# EasyEDA schematic SHC_USB_HUB.json
TITLE: Sheet_1; REV: 1.0; Date: 2024-05-03; Sheet: 1/1; Drawn By: scooter_y; Company: Your Company
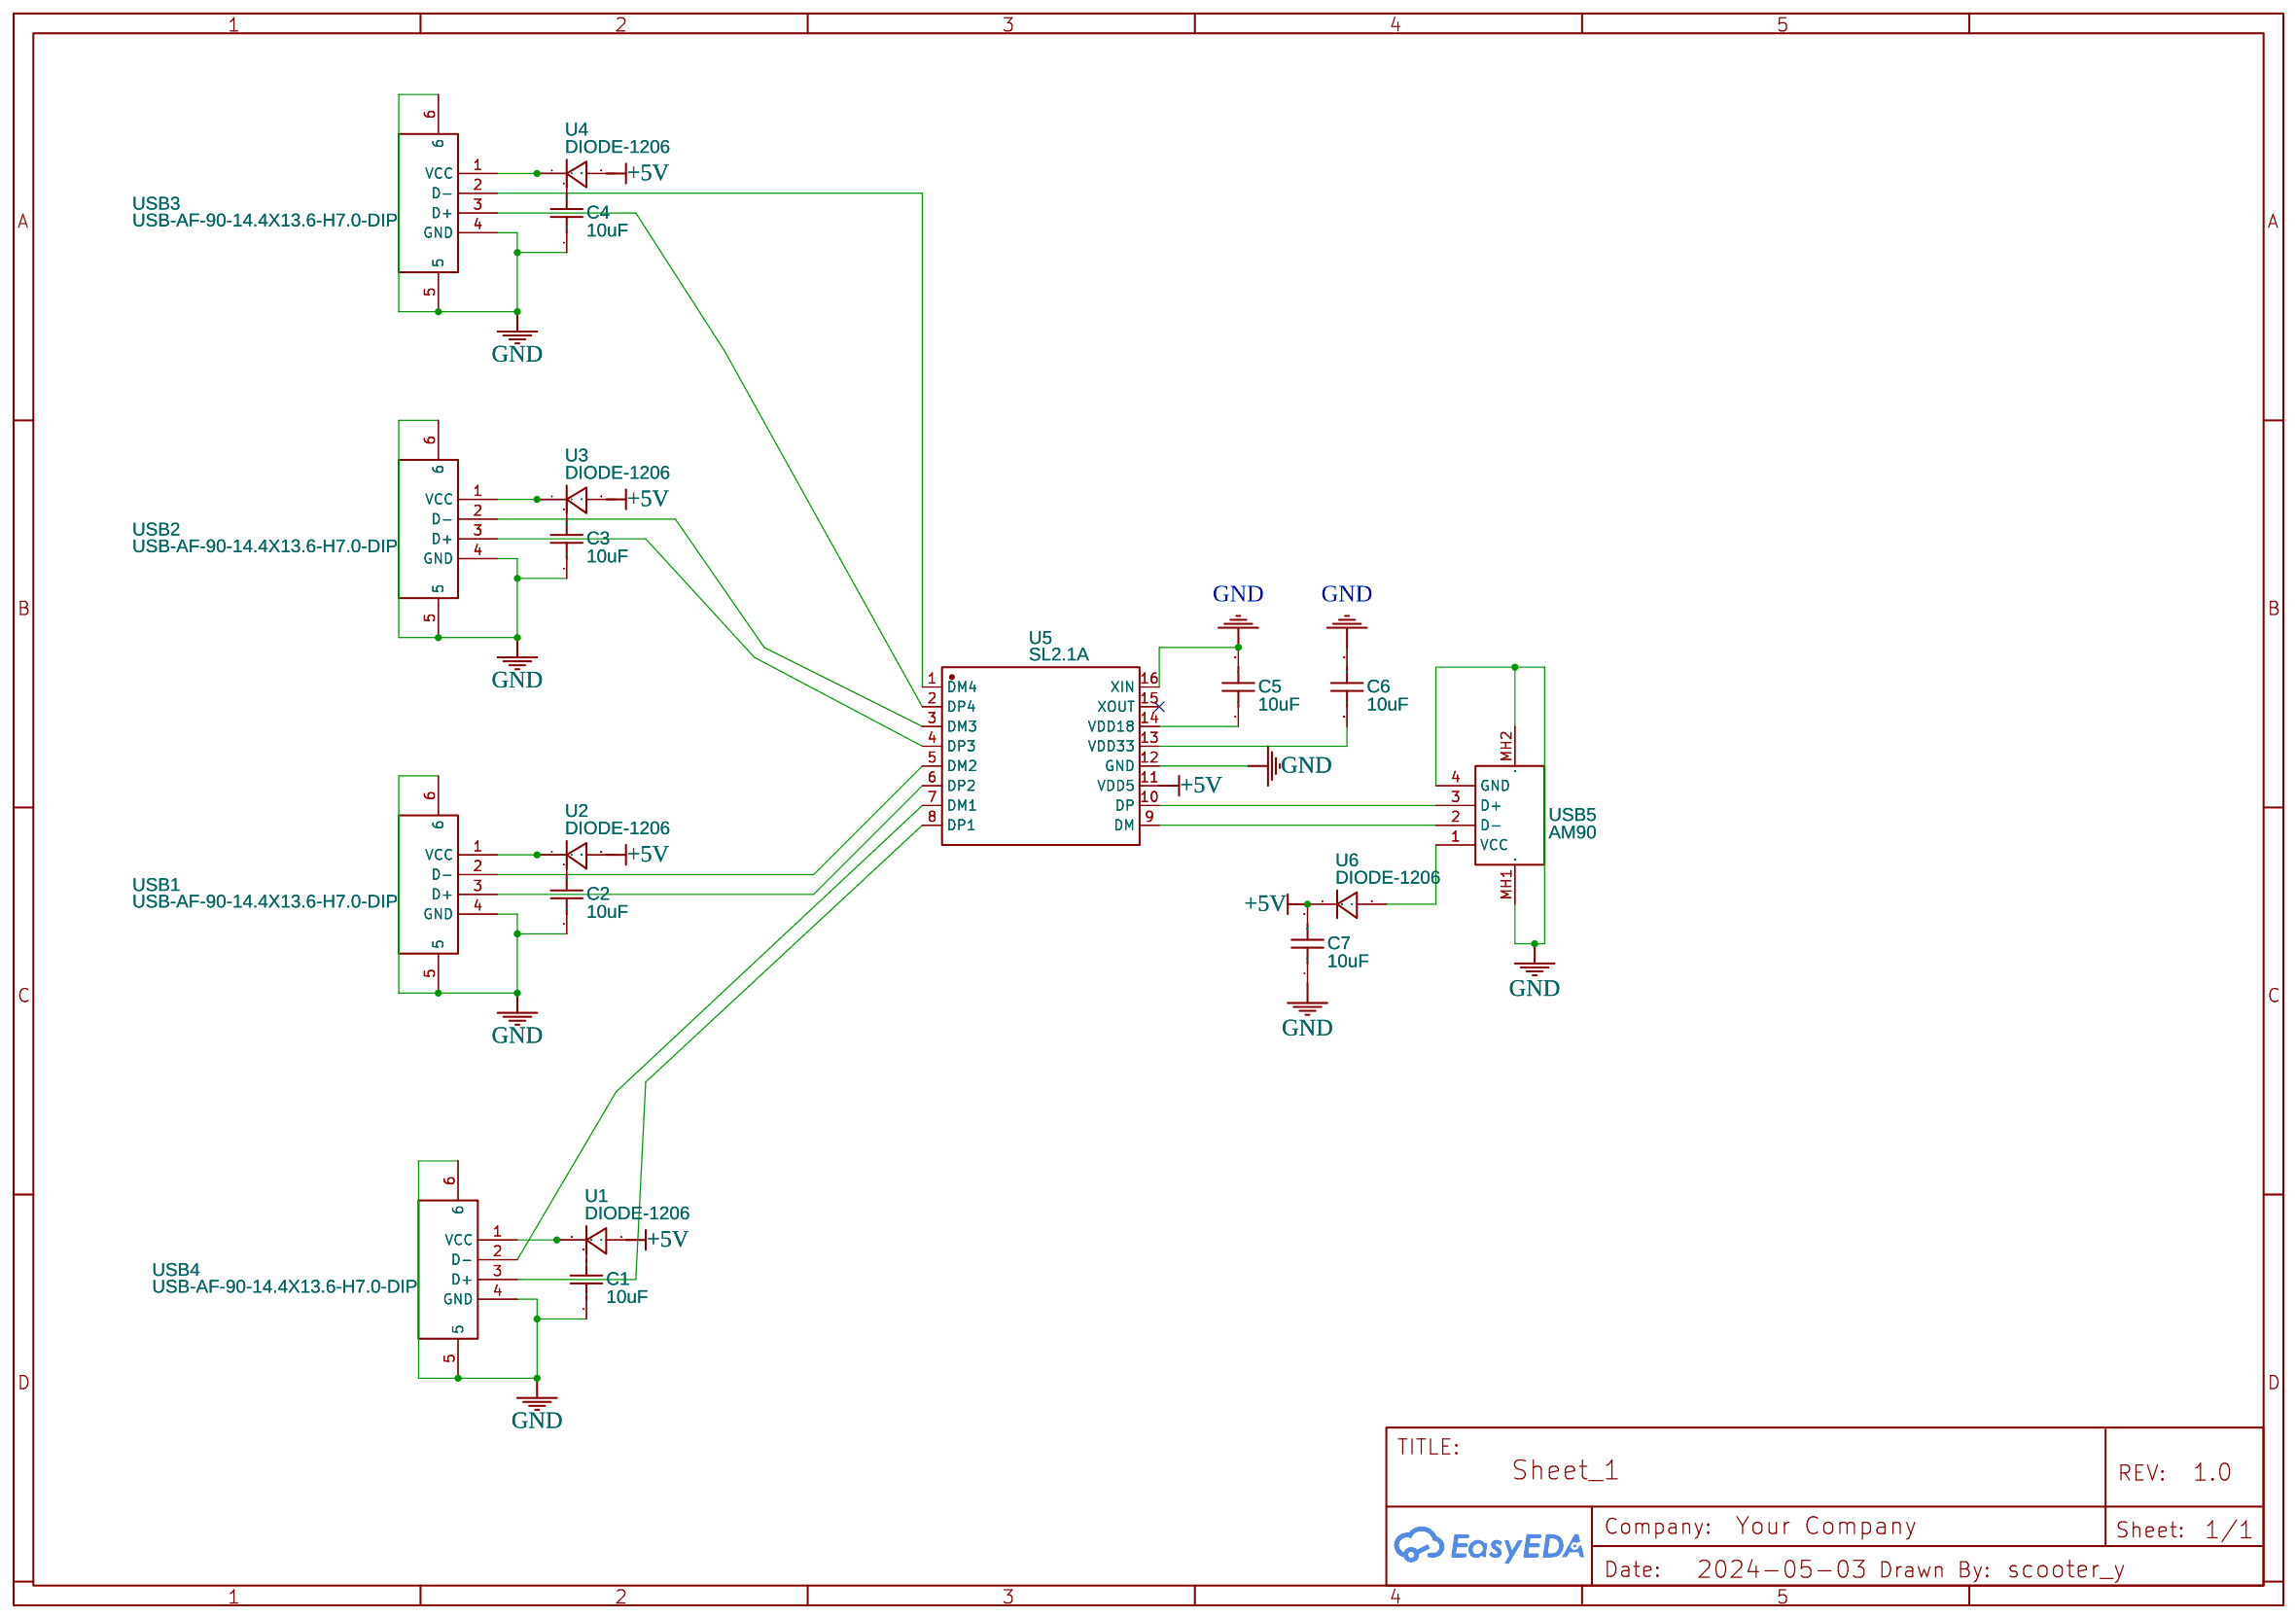
[diagram p0: schematic sheet]

## Parts
C1  10uF  [C0603]
C2  10uF  [C0603]
C3  10uF  [C0603]
C4  10uF  [C0603]
C5  10uF  [C0603]
C6  10uF  [C0603]
C7  10uF  [C0603]
U1  DIODE-1206  [LL-34_L3.5-W1.5-RD]
U2  DIODE-1206  [LL-34_L3.5-W1.5-RD]
U3  DIODE-1206  [LL-34_L3.5-W1.5-RD]
U4  DIODE-1206  [LL-34_L3.5-W1.5-RD]
U5  SL2.1A  [SOP-16_L10.0-W3.9-P1.27-LS6.0-BL]
U6  DIODE-1206  [LL-34_L3.5-W1.5-RD]
USB1  USB-AF-90-14.4X13.6-H7.0-DIP  [USB-A-TH_C46407]
USB2  USB-AF-90-14.4X13.6-H7.0-DIP  [USB-A-TH_C46407]
USB3  USB-AF-90-14.4X13.6-H7.0-DIP  [USB-A-TH_C46407]
USB4  USB-AF-90-14.4X13.6-H7.0-DIP  [USB-A-TH_C46407]
USB5  AM90  [USB-AM-TH_AM90]

## Library data of the parts
C1-C7 = 10UF: Contributor: LCSC; Supplier: LCSC; Supplier Part: C15415; Manufacturer: SAMSUNG(三星); JLCPCB Part Class: Extended Part
U1-U4 U6 = DIODE-1206: Contributor: lcsc; Supplier: LCSC; Supplier Part: C9900012745; Manufacturer: null; JLCPCB Part Class: Extended Part
U5 = SL2.1A: Contributor: LCSC; Supplier: LCSC; Supplier Part: C192893; Manufacturer: CoreChips(和芯润德); JLCPCB Part Class: Extended Part
USB1-USB4 = USB-AF-90-14.4X13.6-H7.0-DIP: Contributor: LCSC; Supplier: LCSC; Supplier Part: C46407; Manufacturer: 精拓金; Manufacturer Part: 903-131A1011D10100; JLCPCB Part Class: Extended Part
USB5 = AM90: Contributor: LCSC; Supplier: LCSC; Supplier Part: C404965; Manufacturer: SHOU HAN(首韩); JLCPCB Part Class: Extended Part

## Nets
+5V: C7.2 U5.11(VDD5) U6.1
GND: C1.1 C2.1 C3.1 C4.1 C5.2 C6.2 C7.1 U5.12(GND) U5.16(XIN) USB1.4(GND) USB1.5 USB1.6 USB2.4(GND) USB2.5 USB2.6 USB3.4(GND) USB3.5 USB3.6 USB4.4(GND) USB4.5 USB4.6 USB5.4(GND) USB5.MH1 USB5.MH2
Net-(C1-2): C1.2 U1.1 USB4.1(VCC)
Net-(C2-2): C2.2 U2.1 USB1.1(VCC)
Net-(C3-2): C3.2 U3.1 USB2.1(VCC)
Net-(C4-2): C4.2 U4.1 USB3.1(VCC)
Net-(C5-1): C5.1 U5.14(VDD18)
Net-(C6-1): C6.1 U5.13(VDD33)
Net-(U5-1): U5.1(DM4) USB3.2(D-)
Net-(U5-2): U5.2(DP4) USB3.3(D+)
Net-(U5-3): U5.3(DM3) USB2.2(D-)
Net-(U5-4): U5.4(DP3) USB2.3(D+)
Net-(U5-5): U5.5(DM2) USB1.2(D-)
Net-(U5-6): U5.6(DP2) USB1.3(D+)
Net-(U5-7): U5.7(DM1) USB4.2(D-)
Net-(U5-8): U5.8(DP1) USB4.3(D+)
Net-(U5-9): U5.9(DM) USB5.2(D-)
Net-(U5-10): U5.10(DP) USB5.3(D+)
Net-(U6-2): U6.2 USB5.1(VCC)

Not connected (* = marked no-connect by the designer): U1 2; U2 2; U3 2; U4 2; U5 15(XOUT)*
